# Altium schematic sheet Switch.SchDoc
size 177 x 139 mm
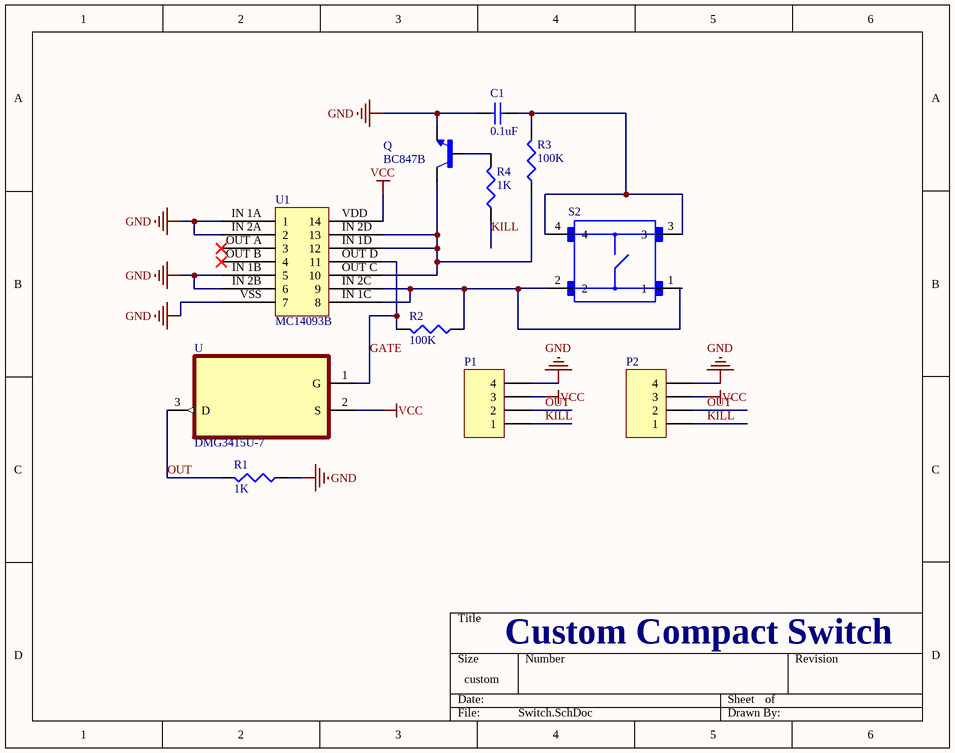
[diagram p0: Switch.SchDoc]

## Parts
C1  value 0.1uF  [C0805]  (hidden comment: Cap Semi)
P1  Header 4  [HDR1X4]  (value not drawn)
P2  Header 4  [HDR1X4]  (value not drawn)
Q  BC847B  [SOT100P230X110-3N]
R1  value 1K  [6-0805_N]  (hidden comment: Res3)
R2  value 100K  [6-0805_N]  (hidden comment: Res3)
R3  value 100K  [6-0805_N]  (hidden comment: Res3)
R4  value 1K  [6-0805_N]  (hidden comment: Res3)
S2  B3F-1000  [B3F4050]  (value not drawn)
U  DMG3415U-7  [SOT95P240X105-3N]
U1  MC14093B  [SOP127P600X175-14N]

## Nets
GND: C1.1 P1.4 P2.4 Q.2(E) R1.1 U1.IN_1A(1) U1.IN_1B(5) U1.IN_2A(2) U1.IN_2B(6) U1.VSS(7)
VCC: P1.3 P2.3 U.2(S) U1.VDD(14)
GATE: R2.2 U.1(G) U1.OUT_D(11)
KILL: P1.1 P2.1 R4.1
OUT: P1.2 P2.2 R1.2 U.3(D)
NetC1_2: C1.2 R3.2 S2.3 S2.4
NetQ_1: Q.1(B) R4.2
NetQ_3: Q.3(C) R3.1 U1.IN_1D(12) U1.IN_2D(13) U1.OUT_C(10)
NetR2_1: R2.1 S2.1 S2.2 U1.IN_1C(8) U1.IN_2C(9)

Not connected (* = marked no-connect by the designer): U1 OUT A(3)* OUT B(4)*

## Notes on the sheet
- Custom Compact Switch

## Library data of the parts
C1 = Cap Semi: Capacitor (Semiconductor SIM Model); Published: 8-Jun-2000; LatestRevisionDate: 29-May-2009; LatestRevisionNote: IPC-7351 Footprint Added.; PackageReference: C1206; Publisher: Altium Limited; PackageDescription: Chip Capacitor
P1 P2 = Header 4: Header, 4-Pin; LatestRevisionDate: 17-Jul-2002; LatestRevisionNote: Re-released for DXP Platform.; Publisher: Altium Limited
Q = BC847B: Bipolar (BJT) Transistor NPN 45V 100mA 100MHz 150mW Surface Mount SOT-523; MF: STMicroelectronics; Availability: Unavailable; Package: SOT-23-3 NXP Semiconductors; Price: None; SnapEDA_Link: https://www.snapeda.com/parts/BC847B/STMicroelectronics/view-part/945669/?ref=snap; Value: *; MP: BC847B
R1-R4 = Res3: Resistor; Published: 8-Jun-2000; LatestRevisionDate: 29-May-2009; LatestRevisionNote: IPC-7351 Footprint Added.; PackageReference: J1-0603; Publisher: Altium Limited; PackageDescription: Chip Resistor
S2 = B3F-1000: Switch, FLUX TIGHT MECHANICAL KEYSwitch, , 50MA@24VDC, NO GROUND TERM., FLAT PLUNG; MF: {'manufacturer': u'Omron'}; MP: B3F-1000; Package: None; Price: None; Availability: Unavailable; Value: *
U = DMG3415U-7: P-Channel 20V 4A _Ta_ 900mW _Ta_ Surface Mount SOT-23-3; MF: Diodes Inc.; Package: SOT-23-3 Diodes Inc.; DigiKey-Purchase-URL: https://snapeda.com/shop?store=DigiKey&id=82858; Availability: Unavailable; Value: *; MP: DMG3415U-7; Price: None; SnapEDA_Link: https://www.snapeda.com/parts/DMG3415U-7/Diodes%20Inc./view-part/82858/?ref=snap
U1 = MC14093B: Quad 2-Input “NAND"  Schmitt Trigger